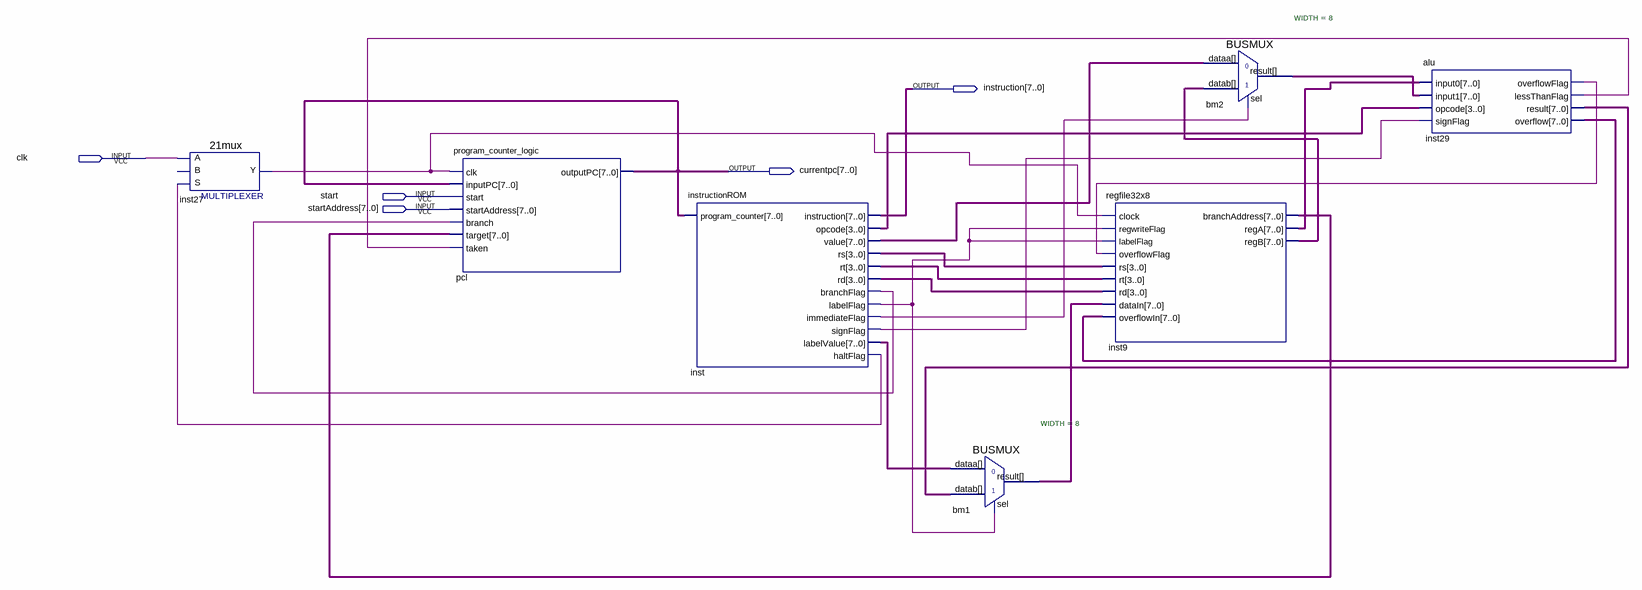
[diagram p0: schematic sheet]
// Quartus schematic CS141L.bdf as structural Verilog: 7 symbols, 5 pins
module CS141L (
  input  clk,
  input  start,
  input  [7:0] startAddress,
  output [7:0] instruction,
  output [7:0] currentpc
);

  wire inst27_y, inst29_lessthanflag, inst29_overflowflag, inst_branchflag, inst_haltflag,
       inst_immediateflag, inst_labelflag, inst_signflag;
  wire [3:0] inst_opcode, inst_rd, inst_rs, inst_rt;
  wire [7:0] bm1_result, bm2_result, inst9_branchaddress, inst9_rega, inst9_regb, inst29_overflow,
       inst29_result, inst_labelvalue, inst_value;

  \21mux  inst27 (.S(inst_haltflag), .A(clk), .Y(inst27_y));  // open: B
  program_counter_logic pcl (
    .clk(inst27_y), .inputPC(currentpc), .start(start), .startAddress(startAddress),
    .branch(inst_branchflag), .target(inst9_branchaddress), .taken(inst29_lessthanflag), .outputPC(currentpc));
  instructionROM inst (
    .program_counter(currentpc), .instruction(instruction), .opcode(inst_opcode), .value(inst_value),
    .rs(inst_rs), .rt(inst_rt), .rd(inst_rd), .branchFlag(inst_branchflag), .labelFlag(inst_labelflag),
    .immediateFlag(inst_immediateflag), .signFlag(inst_signflag), .labelValue(inst_labelvalue),
    .haltFlag(inst_haltflag));
  BUSMUX #(.WIDTH(8)) bm1 (.datab(inst29_result), .sel(inst_labelflag), .dataa(inst_labelvalue), .result(bm1_result));
  regfile32x8 inst9 (
    .clock(inst27_y), .regwriteFlag(inst_labelflag), .labelFlag(inst_labelflag),
    .overflowFlag(inst29_overflowflag), .rs(inst_rs), .rt(inst_rt), .rd(inst_rd), .dataIn(bm1_result),
    .overflowIn(inst29_overflow), .branchAddress(inst9_branchaddress), .regA(inst9_rega), .regB(inst9_regb));
  BUSMUX #(.WIDTH(8)) bm2 (.datab(inst9_regb), .sel(inst_immediateflag), .dataa(inst_value), .result(bm2_result));
  alu inst29 (
    .input0(inst9_rega), .input1(bm2_result), .opcode(inst_opcode), .signFlag(inst_signflag),
    .overflowFlag(inst29_overflowflag), .lessThanFlag(inst29_lessthanflag), .result(inst29_result),
    .overflow(inst29_overflow));
endmodule
